# Vivado block design finn_design, xczu7ev-ffvc1156-2-e, Vivado 2024.1
create_bd_design finn_design

create_bd_intf_port -mode Slave -vlnv xilinx.com:interface:axis_rtl:1.0 s_axis_0
set_property -dict [list \
  CONFIG.FREQ_HZ 250000000 \
  CONFIG.HAS_TKEEP 0 \
  CONFIG.HAS_TLAST 0 \
  CONFIG.HAS_TREADY 1 \
  CONFIG.HAS_TSTRB 0 \
  CONFIG.LAYERED_METADATA undef \
  CONFIG.TDATA_NUM_BYTES 2 \
  CONFIG.TDEST_WIDTH 0 \
  CONFIG.TID_WIDTH 0 \
  CONFIG.TUSER_WIDTH 0 \
] [get_bd_intf_ports s_axis_0]
create_bd_intf_port -mode Master -vlnv xilinx.com:interface:axis_rtl:1.0 m_axis_0
set_property -dict {CONFIG.FREQ_HZ 250000000} [get_bd_intf_ports m_axis_0]
create_bd_port -dir I -type clk ap_clk
set_property -dict {CONFIG.FREQ_HZ 250000000} [get_bd_ports ap_clk]
create_bd_port -dir I -type rst ap_rst_n

create_bd_cell -type module -reference StreamingFIFO_rtl_0 StreamingFIFO_rtl_0
create_bd_cell -type module -reference FMPadding_rtl_0 FMPadding_rtl_0
create_bd_cell -type hier StreamingFIFO_rtl_1_0
create_bd_cell -type module -reference StreamingFIFO_rtl_1_1 StreamingFIFO_rtl_1_1
create_bd_cell -type module -reference StreamingDataWidthConverter_rtl_0 StreamingDataWidthConverter_rtl_0
create_bd_cell -type hier StreamingFIFO_rtl_2_0
create_bd_cell -type module -reference StreamingFIFO_rtl_2_1 StreamingFIFO_rtl_2_1
create_bd_cell -type module -reference ConvolutionInputGenerator_rtl_0 ConvolutionInputGenerator_rtl_0
create_bd_cell -type hier StreamingFIFO_rtl_3_0
create_bd_cell -type hier StreamingFIFO_rtl_3_1
create_bd_cell -type module -reference StreamingFIFO_rtl_3_2 StreamingFIFO_rtl_3_2
create_bd_cell -type module -reference StreamingFIFO_rtl_3_3 StreamingFIFO_rtl_3_3
create_bd_cell -type module -reference StreamingDataWidthConverter_rtl_1 StreamingDataWidthConverter_rtl_1
create_bd_cell -type hier StreamingFIFO_rtl_4
create_bd_cell -type hier MVAU_rtl_0
create_bd_cell -type module -reference StreamingFIFO_rtl_5 StreamingFIFO_rtl_5
create_bd_cell -type module -reference Thresholding_rtl_0_axi_wrapper Thresholding_rtl_0
create_bd_cell -type hier StreamingFIFO_rtl_6_0
create_bd_cell -type hier StreamingFIFO_rtl_6_1
create_bd_cell -type hier StreamingFIFO_rtl_6_2
create_bd_cell -type hier StreamingFIFO_rtl_6_3
create_bd_cell -type module -reference StreamingFIFO_rtl_6_4 StreamingFIFO_rtl_6_4
create_bd_cell -type ip -vlnv xilinx.com:hls:StreamingMaxPool_hls_0:1.0 StreamingMaxPool_hls_0
create_bd_cell -type module -reference StreamingFIFO_rtl_7 StreamingFIFO_rtl_7
create_bd_cell -type module -reference StreamingDataWidthConverter_rtl_2 StreamingDataWidthConverter_rtl_2
create_bd_cell -type module -reference StreamingFIFO_rtl_8 StreamingFIFO_rtl_8
create_bd_cell -type module -reference FMPadding_rtl_1 FMPadding_rtl_1
create_bd_cell -type module -reference StreamingFIFO_rtl_9 StreamingFIFO_rtl_9
create_bd_cell -type module -reference StreamingDataWidthConverter_rtl_3 StreamingDataWidthConverter_rtl_3
create_bd_cell -type module -reference StreamingFIFO_rtl_10 StreamingFIFO_rtl_10
create_bd_cell -type module -reference ConvolutionInputGenerator_rtl_1 ConvolutionInputGenerator_rtl_1
create_bd_cell -type module -reference StreamingFIFO_rtl_11 StreamingFIFO_rtl_11
create_bd_cell -type module -reference StreamingDataWidthConverter_rtl_4 StreamingDataWidthConverter_rtl_4
create_bd_cell -type module -reference StreamingFIFO_rtl_12 StreamingFIFO_rtl_12
create_bd_cell -type hier MVAU_rtl_1
create_bd_cell -type module -reference StreamingFIFO_rtl_13 StreamingFIFO_rtl_13
create_bd_cell -type module -reference StreamingDataWidthConverter_rtl_5 StreamingDataWidthConverter_rtl_5
create_bd_cell -type module -reference StreamingFIFO_rtl_14 StreamingFIFO_rtl_14
create_bd_cell -type module -reference Thresholding_rtl_1_axi_wrapper Thresholding_rtl_1
create_bd_cell -type module -reference StreamingFIFO_rtl_15 StreamingFIFO_rtl_15
create_bd_cell -type ip -vlnv xilinx.com:hls:StreamingMaxPool_hls_1:1.0 StreamingMaxPool_hls_1
create_bd_cell -type module -reference StreamingFIFO_rtl_16 StreamingFIFO_rtl_16
create_bd_cell -type module -reference StreamingDataWidthConverter_rtl_6 StreamingDataWidthConverter_rtl_6
create_bd_cell -type module -reference StreamingFIFO_rtl_17 StreamingFIFO_rtl_17
create_bd_cell -type module -reference FMPadding_rtl_2 FMPadding_rtl_2
create_bd_cell -type module -reference StreamingFIFO_rtl_18 StreamingFIFO_rtl_18
create_bd_cell -type module -reference StreamingDataWidthConverter_rtl_7 StreamingDataWidthConverter_rtl_7
create_bd_cell -type module -reference StreamingFIFO_rtl_19 StreamingFIFO_rtl_19
create_bd_cell -type module -reference ConvolutionInputGenerator_rtl_2 ConvolutionInputGenerator_rtl_2
create_bd_cell -type module -reference StreamingFIFO_rtl_20 StreamingFIFO_rtl_20
create_bd_cell -type module -reference StreamingDataWidthConverter_rtl_8 StreamingDataWidthConverter_rtl_8
create_bd_cell -type module -reference StreamingFIFO_rtl_21 StreamingFIFO_rtl_21
create_bd_cell -type hier MVAU_rtl_2
create_bd_cell -type module -reference StreamingFIFO_rtl_22 StreamingFIFO_rtl_22
create_bd_cell -type module -reference StreamingDataWidthConverter_rtl_9 StreamingDataWidthConverter_rtl_9
create_bd_cell -type module -reference StreamingFIFO_rtl_23 StreamingFIFO_rtl_23
create_bd_cell -type module -reference Thresholding_rtl_2_axi_wrapper Thresholding_rtl_2
create_bd_cell -type module -reference StreamingFIFO_rtl_24 StreamingFIFO_rtl_24
create_bd_cell -type ip -vlnv xilinx.com:hls:StreamingMaxPool_hls_2:1.0 StreamingMaxPool_hls_2
create_bd_cell -type module -reference StreamingFIFO_rtl_25 StreamingFIFO_rtl_25
create_bd_cell -type module -reference StreamingDataWidthConverter_rtl_10 StreamingDataWidthConverter_rtl_10
create_bd_cell -type module -reference StreamingFIFO_rtl_26 StreamingFIFO_rtl_26
create_bd_cell -type module -reference FMPadding_rtl_3 FMPadding_rtl_3
create_bd_cell -type module -reference StreamingFIFO_rtl_27 StreamingFIFO_rtl_27
create_bd_cell -type module -reference StreamingDataWidthConverter_rtl_11 StreamingDataWidthConverter_rtl_11
create_bd_cell -type module -reference StreamingFIFO_rtl_28 StreamingFIFO_rtl_28
create_bd_cell -type module -reference ConvolutionInputGenerator_rtl_3 ConvolutionInputGenerator_rtl_3
create_bd_cell -type module -reference StreamingFIFO_rtl_29 StreamingFIFO_rtl_29
create_bd_cell -type module -reference StreamingDataWidthConverter_rtl_12 StreamingDataWidthConverter_rtl_12
create_bd_cell -type module -reference StreamingFIFO_rtl_30 StreamingFIFO_rtl_30
create_bd_cell -type hier MVAU_rtl_3
create_bd_cell -type module -reference StreamingFIFO_rtl_31 StreamingFIFO_rtl_31
create_bd_cell -type module -reference StreamingDataWidthConverter_rtl_13 StreamingDataWidthConverter_rtl_13
create_bd_cell -type module -reference StreamingFIFO_rtl_32 StreamingFIFO_rtl_32
create_bd_cell -type module -reference Thresholding_rtl_3_axi_wrapper Thresholding_rtl_3
create_bd_cell -type module -reference StreamingFIFO_rtl_33 StreamingFIFO_rtl_33
create_bd_cell -type ip -vlnv xilinx.com:hls:StreamingMaxPool_hls_3:1.0 StreamingMaxPool_hls_3
create_bd_cell -type module -reference StreamingFIFO_rtl_34 StreamingFIFO_rtl_34
create_bd_cell -type module -reference StreamingDataWidthConverter_rtl_14 StreamingDataWidthConverter_rtl_14
create_bd_cell -type module -reference StreamingFIFO_rtl_35 StreamingFIFO_rtl_35
create_bd_cell -type module -reference FMPadding_rtl_4 FMPadding_rtl_4
create_bd_cell -type module -reference StreamingFIFO_rtl_36 StreamingFIFO_rtl_36
create_bd_cell -type module -reference StreamingDataWidthConverter_rtl_15 StreamingDataWidthConverter_rtl_15
create_bd_cell -type module -reference StreamingFIFO_rtl_37 StreamingFIFO_rtl_37
create_bd_cell -type module -reference ConvolutionInputGenerator_rtl_4 ConvolutionInputGenerator_rtl_4
create_bd_cell -type module -reference StreamingFIFO_rtl_38 StreamingFIFO_rtl_38
create_bd_cell -type module -reference StreamingDataWidthConverter_rtl_16 StreamingDataWidthConverter_rtl_16
create_bd_cell -type module -reference StreamingFIFO_rtl_39 StreamingFIFO_rtl_39
create_bd_cell -type hier MVAU_rtl_4
create_bd_cell -type module -reference StreamingFIFO_rtl_40 StreamingFIFO_rtl_40
create_bd_cell -type module -reference StreamingDataWidthConverter_rtl_17 StreamingDataWidthConverter_rtl_17
create_bd_cell -type module -reference StreamingFIFO_rtl_41 StreamingFIFO_rtl_41
create_bd_cell -type module -reference Thresholding_rtl_4_axi_wrapper Thresholding_rtl_4
create_bd_cell -type module -reference StreamingFIFO_rtl_42 StreamingFIFO_rtl_42
create_bd_cell -type ip -vlnv xilinx.com:hls:StreamingMaxPool_hls_4:1.0 StreamingMaxPool_hls_4
create_bd_cell -type module -reference StreamingFIFO_rtl_43 StreamingFIFO_rtl_43
create_bd_cell -type module -reference StreamingDataWidthConverter_rtl_18 StreamingDataWidthConverter_rtl_18
create_bd_cell -type module -reference StreamingFIFO_rtl_44 StreamingFIFO_rtl_44
create_bd_cell -type module -reference FMPadding_rtl_5 FMPadding_rtl_5
create_bd_cell -type module -reference StreamingFIFO_rtl_45 StreamingFIFO_rtl_45
create_bd_cell -type module -reference StreamingDataWidthConverter_rtl_19 StreamingDataWidthConverter_rtl_19
create_bd_cell -type module -reference StreamingFIFO_rtl_46 StreamingFIFO_rtl_46
create_bd_cell -type module -reference ConvolutionInputGenerator_rtl_5 ConvolutionInputGenerator_rtl_5
create_bd_cell -type module -reference StreamingFIFO_rtl_47 StreamingFIFO_rtl_47
create_bd_cell -type module -reference StreamingDataWidthConverter_rtl_20 StreamingDataWidthConverter_rtl_20
create_bd_cell -type module -reference StreamingFIFO_rtl_48 StreamingFIFO_rtl_48
create_bd_cell -type hier MVAU_rtl_5
create_bd_cell -type module -reference StreamingFIFO_rtl_49 StreamingFIFO_rtl_49
create_bd_cell -type module -reference Thresholding_rtl_5_axi_wrapper Thresholding_rtl_5
create_bd_cell -type module -reference StreamingFIFO_rtl_50 StreamingFIFO_rtl_50
create_bd_cell -type ip -vlnv xilinx.com:hls:StreamingMaxPool_hls_5:1.0 StreamingMaxPool_hls_5
create_bd_cell -type module -reference StreamingFIFO_rtl_51 StreamingFIFO_rtl_51
create_bd_cell -type module -reference StreamingDataWidthConverter_rtl_21 StreamingDataWidthConverter_rtl_21
create_bd_cell -type module -reference StreamingFIFO_rtl_52 StreamingFIFO_rtl_52
create_bd_cell -type module -reference FMPadding_rtl_6 FMPadding_rtl_6
create_bd_cell -type module -reference StreamingFIFO_rtl_53 StreamingFIFO_rtl_53
create_bd_cell -type module -reference StreamingDataWidthConverter_rtl_22 StreamingDataWidthConverter_rtl_22
create_bd_cell -type module -reference StreamingFIFO_rtl_54 StreamingFIFO_rtl_54
create_bd_cell -type module -reference ConvolutionInputGenerator_rtl_6 ConvolutionInputGenerator_rtl_6
create_bd_cell -type module -reference StreamingFIFO_rtl_55 StreamingFIFO_rtl_55
create_bd_cell -type module -reference StreamingDataWidthConverter_rtl_23 StreamingDataWidthConverter_rtl_23
create_bd_cell -type module -reference StreamingFIFO_rtl_56 StreamingFIFO_rtl_56
create_bd_cell -type hier MVAU_rtl_6
create_bd_cell -type module -reference StreamingFIFO_rtl_57 StreamingFIFO_rtl_57
create_bd_cell -type module -reference Thresholding_rtl_6_axi_wrapper Thresholding_rtl_6
create_bd_cell -type module -reference StreamingFIFO_rtl_58 StreamingFIFO_rtl_58
create_bd_cell -type ip -vlnv xilinx.com:hls:StreamingMaxPool_hls_6:1.0 StreamingMaxPool_hls_6
create_bd_cell -type module -reference StreamingFIFO_rtl_59 StreamingFIFO_rtl_59
create_bd_cell -type hier MVAU_rtl_7
create_bd_cell -type module -reference StreamingFIFO_rtl_60 StreamingFIFO_rtl_60
create_bd_cell -type module -reference Thresholding_rtl_7_axi_wrapper Thresholding_rtl_7
create_bd_cell -type module -reference StreamingFIFO_rtl_61 StreamingFIFO_rtl_61
create_bd_cell -type hier MVAU_rtl_8
create_bd_cell -type module -reference StreamingFIFO_rtl_62 StreamingFIFO_rtl_62
create_bd_cell -type module -reference Thresholding_rtl_8_axi_wrapper Thresholding_rtl_8
create_bd_cell -type module -reference StreamingFIFO_rtl_63 StreamingFIFO_rtl_63
create_bd_cell -type hier MVAU_rtl_9
create_bd_cell -type module -reference StreamingFIFO_rtl_64 StreamingFIFO_rtl_64
create_bd_cell -type ip -vlnv xilinx.com:hls:ChannelwiseOp_hls_0:1.0 ChannelwiseOp_hls_0
create_bd_cell -type module -reference StreamingFIFO_rtl_65 StreamingFIFO_rtl_65
create_bd_cell -type ip -vlnv xilinx.com:hls:LabelSelect_hls_0:1.0 LabelSelect_hls_0
create_bd_cell -type module -reference StreamingFIFO_rtl_66 StreamingFIFO_rtl_66

# ---- hierarchy /StreamingFIFO_rtl_1_0 ----
current_bd_instance /StreamingFIFO_rtl_1_0
create_bd_intf_pin -mode Master -vlnv xilinx.com:interface:axis_rtl:1.0 out_V
create_bd_intf_pin -mode Slave -vlnv xilinx.com:interface:axis_rtl:1.0 in0_V
create_bd_pin -dir I -type clk ap_clk
create_bd_pin -dir I -type rst ap_rst_n

create_bd_cell -type ip -vlnv xilinx.com:ip:axis_data_fifo:2.0 fifo
set_property -dict {CONFIG.FIFO_DEPTH 1024 CONFIG.FIFO_MEMORY_TYPE auto CONFIG.TDATA_NUM_BYTES 2} [get_bd_cells fifo]

# ---- hierarchy /StreamingFIFO_rtl_2_0 ----
current_bd_instance /StreamingFIFO_rtl_2_0
create_bd_intf_pin -mode Master -vlnv xilinx.com:interface:axis_rtl:1.0 out_V
create_bd_intf_pin -mode Slave -vlnv xilinx.com:interface:axis_rtl:1.0 in0_V
create_bd_pin -dir I -type clk ap_clk
create_bd_pin -dir I -type rst ap_rst_n

create_bd_cell -type ip -vlnv xilinx.com:ip:axis_data_fifo:2.0 fifo
set_property -dict {CONFIG.FIFO_DEPTH 2048 CONFIG.FIFO_MEMORY_TYPE auto CONFIG.TDATA_NUM_BYTES 1} [get_bd_cells fifo]

# ---- hierarchy /StreamingFIFO_rtl_3_0 ----
current_bd_instance /StreamingFIFO_rtl_3_0
create_bd_intf_pin -mode Master -vlnv xilinx.com:interface:axis_rtl:1.0 out_V
create_bd_intf_pin -mode Slave -vlnv xilinx.com:interface:axis_rtl:1.0 in0_V
create_bd_pin -dir I -type clk ap_clk
create_bd_pin -dir I -type rst ap_rst_n

create_bd_cell -type ip -vlnv xilinx.com:ip:axis_data_fifo:2.0 fifo
set_property -dict {CONFIG.FIFO_DEPTH 4096 CONFIG.FIFO_MEMORY_TYPE auto CONFIG.TDATA_NUM_BYTES 1} [get_bd_cells fifo]

# ---- hierarchy /StreamingFIFO_rtl_3_1 ----
current_bd_instance /StreamingFIFO_rtl_3_1
create_bd_intf_pin -mode Master -vlnv xilinx.com:interface:axis_rtl:1.0 out_V
create_bd_intf_pin -mode Slave -vlnv xilinx.com:interface:axis_rtl:1.0 in0_V
create_bd_pin -dir I -type clk ap_clk
create_bd_pin -dir I -type rst ap_rst_n

create_bd_cell -type ip -vlnv xilinx.com:ip:axis_data_fifo:2.0 fifo
set_property -dict {CONFIG.FIFO_DEPTH 512 CONFIG.FIFO_MEMORY_TYPE auto CONFIG.TDATA_NUM_BYTES 1} [get_bd_cells fifo]

# ---- hierarchy /StreamingFIFO_rtl_4 ----
current_bd_instance /StreamingFIFO_rtl_4
create_bd_intf_pin -mode Master -vlnv xilinx.com:interface:axis_rtl:1.0 out_V
create_bd_intf_pin -mode Slave -vlnv xilinx.com:interface:axis_rtl:1.0 in0_V
create_bd_pin -dir I -type clk ap_clk
create_bd_pin -dir I -type rst ap_rst_n

create_bd_cell -type ip -vlnv xilinx.com:ip:axis_data_fifo:2.0 fifo
set_property -dict {CONFIG.FIFO_DEPTH 1024 CONFIG.FIFO_MEMORY_TYPE auto CONFIG.TDATA_NUM_BYTES 6} [get_bd_cells fifo]

# ---- hierarchy /MVAU_rtl_0 ----
current_bd_instance /MVAU_rtl_0
create_bd_intf_pin -mode Master -vlnv xilinx.com:interface:axis_rtl:1.0 out_V
create_bd_intf_pin -mode Slave -vlnv xilinx.com:interface:axis_rtl:1.0 in0_V
create_bd_pin -dir I -type clk ap_clk
create_bd_pin -dir I -type rst ap_rst_n

create_bd_cell -type module -reference MVAU_rtl_0 MVAU_rtl_0
create_bd_cell -type ip -vlnv amd.com:finn:memstream:1.0 MVAU_rtl_0_wstrm
set_property -dict [list \
  CONFIG.DEPTH 64 \
  CONFIG.INIT_FILE /home/phu/repos/PytorchModClassNew/RadioFINN/notebooks/Radio_27ML/tmp//code_gen_ipgen_MVAU_rtl_0_stk8ixk_/memblock.dat \
  CONFIG.RAM_STYLE auto \
  CONFIG.WIDTH 48 \
] [get_bd_cells MVAU_rtl_0_wstrm]

# ---- hierarchy /StreamingFIFO_rtl_6_0 ----
current_bd_instance /StreamingFIFO_rtl_6_0
create_bd_intf_pin -mode Master -vlnv xilinx.com:interface:axis_rtl:1.0 out_V
create_bd_intf_pin -mode Slave -vlnv xilinx.com:interface:axis_rtl:1.0 in0_V
create_bd_pin -dir I -type clk ap_clk
create_bd_pin -dir I -type rst ap_rst_n

create_bd_cell -type ip -vlnv xilinx.com:ip:axis_data_fifo:2.0 fifo
set_property -dict {CONFIG.FIFO_DEPTH 32768 CONFIG.FIFO_MEMORY_TYPE auto CONFIG.TDATA_NUM_BYTES 1} [get_bd_cells fifo]

# ---- hierarchy /StreamingFIFO_rtl_6_1 ----
current_bd_instance /StreamingFIFO_rtl_6_1
create_bd_intf_pin -mode Master -vlnv xilinx.com:interface:axis_rtl:1.0 out_V
create_bd_intf_pin -mode Slave -vlnv xilinx.com:interface:axis_rtl:1.0 in0_V
create_bd_pin -dir I -type clk ap_clk
create_bd_pin -dir I -type rst ap_rst_n

create_bd_cell -type ip -vlnv xilinx.com:ip:axis_data_fifo:2.0 fifo
set_property -dict {CONFIG.FIFO_DEPTH 8192 CONFIG.FIFO_MEMORY_TYPE auto CONFIG.TDATA_NUM_BYTES 1} [get_bd_cells fifo]

# ---- hierarchy /StreamingFIFO_rtl_6_2 ----
current_bd_instance /StreamingFIFO_rtl_6_2
create_bd_intf_pin -mode Master -vlnv xilinx.com:interface:axis_rtl:1.0 out_V
create_bd_intf_pin -mode Slave -vlnv xilinx.com:interface:axis_rtl:1.0 in0_V
create_bd_pin -dir I -type clk ap_clk
create_bd_pin -dir I -type rst ap_rst_n

create_bd_cell -type ip -vlnv xilinx.com:ip:axis_data_fifo:2.0 fifo
set_property -dict {CONFIG.FIFO_DEPTH 4096 CONFIG.FIFO_MEMORY_TYPE auto CONFIG.TDATA_NUM_BYTES 1} [get_bd_cells fifo]

# ---- hierarchy /StreamingFIFO_rtl_6_3 ----
current_bd_instance /StreamingFIFO_rtl_6_3
create_bd_intf_pin -mode Master -vlnv xilinx.com:interface:axis_rtl:1.0 out_V
create_bd_intf_pin -mode Slave -vlnv xilinx.com:interface:axis_rtl:1.0 in0_V
create_bd_pin -dir I -type clk ap_clk
create_bd_pin -dir I -type rst ap_rst_n

create_bd_cell -type ip -vlnv xilinx.com:ip:axis_data_fifo:2.0 fifo
set_property -dict {CONFIG.FIFO_DEPTH 2048 CONFIG.FIFO_MEMORY_TYPE auto CONFIG.TDATA_NUM_BYTES 1} [get_bd_cells fifo]

# ---- hierarchy /MVAU_rtl_1 ----
current_bd_instance /MVAU_rtl_1
create_bd_intf_pin -mode Master -vlnv xilinx.com:interface:axis_rtl:1.0 out_V
create_bd_intf_pin -mode Slave -vlnv xilinx.com:interface:axis_rtl:1.0 in0_V
create_bd_pin -dir I -type clk ap_clk
create_bd_pin -dir I -type rst ap_rst_n

create_bd_cell -type module -reference MVAU_rtl_1 MVAU_rtl_1
create_bd_cell -type ip -vlnv amd.com:finn:memstream:1.0 MVAU_rtl_1_wstrm
set_property -dict [list \
  CONFIG.DEPTH 96 \
  CONFIG.INIT_FILE /home/phu/repos/PytorchModClassNew/RadioFINN/notebooks/Radio_27ML/tmp//code_gen_ipgen_MVAU_rtl_1_zqeudctg/memblock.dat \
  CONFIG.RAM_STYLE auto \
  CONFIG.WIDTH 1024 \
] [get_bd_cells MVAU_rtl_1_wstrm]

# ---- hierarchy /MVAU_rtl_2 ----
current_bd_instance /MVAU_rtl_2
create_bd_intf_pin -mode Master -vlnv xilinx.com:interface:axis_rtl:1.0 out_V
create_bd_intf_pin -mode Slave -vlnv xilinx.com:interface:axis_rtl:1.0 in0_V
create_bd_pin -dir I -type clk ap_clk
create_bd_pin -dir I -type rst ap_rst_n

create_bd_cell -type module -reference MVAU_rtl_2 MVAU_rtl_2
create_bd_cell -type ip -vlnv amd.com:finn:memstream:1.0 MVAU_rtl_2_wstrm
set_property -dict [list \
  CONFIG.DEPTH 192 \
  CONFIG.INIT_FILE /home/phu/repos/PytorchModClassNew/RadioFINN/notebooks/Radio_27ML/tmp//code_gen_ipgen_MVAU_rtl_2_oeq4dach/memblock.dat \
  CONFIG.RAM_STYLE auto \
  CONFIG.WIDTH 512 \
] [get_bd_cells MVAU_rtl_2_wstrm]

# ---- hierarchy /MVAU_rtl_3 ----
current_bd_instance /MVAU_rtl_3
create_bd_intf_pin -mode Master -vlnv xilinx.com:interface:axis_rtl:1.0 out_V
create_bd_intf_pin -mode Slave -vlnv xilinx.com:interface:axis_rtl:1.0 in0_V
create_bd_pin -dir I -type clk ap_clk
create_bd_pin -dir I -type rst ap_rst_n

create_bd_cell -type module -reference MVAU_rtl_3 MVAU_rtl_3
create_bd_cell -type ip -vlnv amd.com:finn:memstream:1.0 MVAU_rtl_3_wstrm
set_property -dict [list \
  CONFIG.DEPTH 384 \
  CONFIG.INIT_FILE /home/phu/repos/PytorchModClassNew/RadioFINN/notebooks/Radio_27ML/tmp//code_gen_ipgen_MVAU_rtl_3_0ba2zerz/memblock.dat \
  CONFIG.RAM_STYLE auto \
  CONFIG.WIDTH 256 \
] [get_bd_cells MVAU_rtl_3_wstrm]

# ---- hierarchy /MVAU_rtl_4 ----
current_bd_instance /MVAU_rtl_4
create_bd_intf_pin -mode Master -vlnv xilinx.com:interface:axis_rtl:1.0 out_V
create_bd_intf_pin -mode Slave -vlnv xilinx.com:interface:axis_rtl:1.0 in0_V
create_bd_pin -dir I -type clk ap_clk
create_bd_pin -dir I -type rst ap_rst_n

create_bd_cell -type module -reference MVAU_rtl_4 MVAU_rtl_4
create_bd_cell -type ip -vlnv amd.com:finn:memstream:1.0 MVAU_rtl_4_wstrm
set_property -dict [list \
  CONFIG.DEPTH 768 \
  CONFIG.INIT_FILE /home/phu/repos/PytorchModClassNew/RadioFINN/notebooks/Radio_27ML/tmp//code_gen_ipgen_MVAU_rtl_4_ynhrbura/memblock.dat \
  CONFIG.RAM_STYLE auto \
  CONFIG.WIDTH 128 \
] [get_bd_cells MVAU_rtl_4_wstrm]

# ---- hierarchy /MVAU_rtl_5 ----
current_bd_instance /MVAU_rtl_5
create_bd_intf_pin -mode Master -vlnv xilinx.com:interface:axis_rtl:1.0 out_V
create_bd_intf_pin -mode Slave -vlnv xilinx.com:interface:axis_rtl:1.0 in0_V
create_bd_pin -dir I -type clk ap_clk
create_bd_pin -dir I -type rst ap_rst_n

create_bd_cell -type module -reference MVAU_rtl_5 MVAU_rtl_5
create_bd_cell -type ip -vlnv amd.com:finn:memstream:1.0 MVAU_rtl_5_wstrm
set_property -dict [list \
  CONFIG.DEPTH 2048 \
  CONFIG.INIT_FILE /home/phu/repos/PytorchModClassNew/RadioFINN/notebooks/Radio_27ML/tmp//code_gen_ipgen_MVAU_rtl_5_044bw2qu/memblock.dat \
  CONFIG.RAM_STYLE auto \
  CONFIG.WIDTH 48 \
] [get_bd_cells MVAU_rtl_5_wstrm]

# ---- hierarchy /MVAU_rtl_6 ----
current_bd_instance /MVAU_rtl_6
create_bd_intf_pin -mode Master -vlnv xilinx.com:interface:axis_rtl:1.0 out_V
create_bd_intf_pin -mode Slave -vlnv xilinx.com:interface:axis_rtl:1.0 in0_V
create_bd_pin -dir I -type clk ap_clk
create_bd_pin -dir I -type rst ap_rst_n

create_bd_cell -type module -reference MVAU_rtl_6 MVAU_rtl_6
create_bd_cell -type ip -vlnv amd.com:finn:memstream:1.0 MVAU_rtl_6_wstrm
set_property -dict [list \
  CONFIG.DEPTH 4096 \
  CONFIG.INIT_FILE /home/phu/repos/PytorchModClassNew/RadioFINN/notebooks/Radio_27ML/tmp//code_gen_ipgen_MVAU_rtl_6_kudosabw/memblock.dat \
  CONFIG.RAM_STYLE auto \
  CONFIG.WIDTH 24 \
] [get_bd_cells MVAU_rtl_6_wstrm]

# ---- hierarchy /MVAU_rtl_7 ----
current_bd_instance /MVAU_rtl_7
create_bd_intf_pin -mode Master -vlnv xilinx.com:interface:axis_rtl:1.0 out_V
create_bd_intf_pin -mode Slave -vlnv xilinx.com:interface:axis_rtl:1.0 in0_V
create_bd_pin -dir I -type clk ap_clk
create_bd_pin -dir I -type rst ap_rst_n

create_bd_cell -type module -reference MVAU_rtl_7 MVAU_rtl_7
create_bd_cell -type ip -vlnv amd.com:finn:memstream:1.0 MVAU_rtl_7_wstrm
set_property -dict [list \
  CONFIG.DEPTH 65536 \
  CONFIG.INIT_FILE /home/phu/repos/PytorchModClassNew/RadioFINN/notebooks/Radio_27ML/tmp//code_gen_ipgen_MVAU_rtl_7_gfiyws_m/memblock.dat \
  CONFIG.RAM_STYLE auto \
  CONFIG.WIDTH 8 \
] [get_bd_cells MVAU_rtl_7_wstrm]

# ---- hierarchy /MVAU_rtl_8 ----
current_bd_instance /MVAU_rtl_8
create_bd_intf_pin -mode Master -vlnv xilinx.com:interface:axis_rtl:1.0 out_V
create_bd_intf_pin -mode Slave -vlnv xilinx.com:interface:axis_rtl:1.0 in0_V
create_bd_pin -dir I -type clk ap_clk
create_bd_pin -dir I -type rst ap_rst_n

create_bd_cell -type module -reference MVAU_rtl_8 MVAU_rtl_8
create_bd_cell -type ip -vlnv amd.com:finn:memstream:1.0 MVAU_rtl_8_wstrm
set_property -dict [list \
  CONFIG.DEPTH 16384 \
  CONFIG.INIT_FILE /home/phu/repos/PytorchModClassNew/RadioFINN/notebooks/Radio_27ML/tmp//code_gen_ipgen_MVAU_rtl_8_ss72c51x/memblock.dat \
  CONFIG.RAM_STYLE auto \
  CONFIG.WIDTH 8 \
] [get_bd_cells MVAU_rtl_8_wstrm]

# ---- hierarchy /MVAU_rtl_9 ----
current_bd_instance /MVAU_rtl_9
create_bd_intf_pin -mode Master -vlnv xilinx.com:interface:axis_rtl:1.0 out_V
create_bd_intf_pin -mode Slave -vlnv xilinx.com:interface:axis_rtl:1.0 in0_V
create_bd_pin -dir I -type clk ap_clk
create_bd_pin -dir I -type rst ap_rst_n

create_bd_cell -type module -reference MVAU_rtl_9 MVAU_rtl_9
create_bd_cell -type ip -vlnv amd.com:finn:memstream:1.0 MVAU_rtl_9_wstrm
set_property -dict [list \
  CONFIG.DEPTH 3456 \
  CONFIG.INIT_FILE /home/phu/repos/PytorchModClassNew/RadioFINN/notebooks/Radio_27ML/tmp//code_gen_ipgen_MVAU_rtl_9_jqypr93c/memblock.dat \
  CONFIG.RAM_STYLE auto \
  CONFIG.WIDTH 8 \
] [get_bd_cells MVAU_rtl_9_wstrm]

# ---- connections ----

current_bd_instance /StreamingFIFO_rtl_1_0
connect_bd_intf_net [get_bd_intf_pins fifo/M_AXIS] [get_bd_intf_pins out_V]
connect_bd_intf_net [get_bd_intf_pins fifo/S_AXIS] [get_bd_intf_pins in0_V]
connect_bd_net [get_bd_pins ap_clk] [get_bd_pins fifo/s_axis_aclk]
connect_bd_net [get_bd_pins ap_rst_n] [get_bd_pins fifo/s_axis_aresetn]

current_bd_instance /StreamingFIFO_rtl_2_0
connect_bd_intf_net [get_bd_intf_pins fifo/M_AXIS] [get_bd_intf_pins out_V]
connect_bd_intf_net [get_bd_intf_pins fifo/S_AXIS] [get_bd_intf_pins in0_V]
connect_bd_net [get_bd_pins ap_clk] [get_bd_pins fifo/s_axis_aclk]
connect_bd_net [get_bd_pins ap_rst_n] [get_bd_pins fifo/s_axis_aresetn]

current_bd_instance /StreamingFIFO_rtl_3_0
connect_bd_intf_net [get_bd_intf_pins fifo/M_AXIS] [get_bd_intf_pins out_V]
connect_bd_intf_net [get_bd_intf_pins fifo/S_AXIS] [get_bd_intf_pins in0_V]
connect_bd_net [get_bd_pins ap_clk] [get_bd_pins fifo/s_axis_aclk]
connect_bd_net [get_bd_pins ap_rst_n] [get_bd_pins fifo/s_axis_aresetn]

current_bd_instance /StreamingFIFO_rtl_3_1
connect_bd_intf_net [get_bd_intf_pins fifo/M_AXIS] [get_bd_intf_pins out_V]
connect_bd_intf_net [get_bd_intf_pins fifo/S_AXIS] [get_bd_intf_pins in0_V]
connect_bd_net [get_bd_pins ap_clk] [get_bd_pins fifo/s_axis_aclk]
connect_bd_net [get_bd_pins ap_rst_n] [get_bd_pins fifo/s_axis_aresetn]

current_bd_instance /StreamingFIFO_rtl_4
connect_bd_intf_net [get_bd_intf_pins fifo/M_AXIS] [get_bd_intf_pins out_V]
connect_bd_intf_net [get_bd_intf_pins fifo/S_AXIS] [get_bd_intf_pins in0_V]
connect_bd_net [get_bd_pins ap_clk] [get_bd_pins fifo/s_axis_aclk]
connect_bd_net [get_bd_pins ap_rst_n] [get_bd_pins fifo/s_axis_aresetn]

current_bd_instance /MVAU_rtl_0
connect_bd_intf_net [get_bd_intf_pins out_V] [get_bd_intf_pins MVAU_rtl_0/out_V]
connect_bd_intf_net [get_bd_intf_pins MVAU_rtl_0_wstrm/m_axis_0] [get_bd_intf_pins MVAU_rtl_0/weights_V]
connect_bd_intf_net [get_bd_intf_pins in0_V] [get_bd_intf_pins MVAU_rtl_0/in0_V]
connect_bd_net [get_bd_pins ap_clk] [get_bd_pins MVAU_rtl_0_wstrm/ap_clk] [get_bd_pins MVAU_rtl_0/ap_clk]
connect_bd_net [get_bd_pins ap_rst_n] [get_bd_pins MVAU_rtl_0_wstrm/ap_rst_n] [get_bd_pins MVAU_rtl_0/ap_rst_n]

current_bd_instance /StreamingFIFO_rtl_6_0
connect_bd_intf_net [get_bd_intf_pins fifo/M_AXIS] [get_bd_intf_pins out_V]
connect_bd_intf_net [get_bd_intf_pins fifo/S_AXIS] [get_bd_intf_pins in0_V]
connect_bd_net [get_bd_pins ap_clk] [get_bd_pins fifo/s_axis_aclk]
connect_bd_net [get_bd_pins ap_rst_n] [get_bd_pins fifo/s_axis_aresetn]

current_bd_instance /StreamingFIFO_rtl_6_1
connect_bd_intf_net [get_bd_intf_pins fifo/M_AXIS] [get_bd_intf_pins out_V]
connect_bd_intf_net [get_bd_intf_pins fifo/S_AXIS] [get_bd_intf_pins in0_V]
connect_bd_net [get_bd_pins ap_clk] [get_bd_pins fifo/s_axis_aclk]
connect_bd_net [get_bd_pins ap_rst_n] [get_bd_pins fifo/s_axis_aresetn]

current_bd_instance /StreamingFIFO_rtl_6_2
connect_bd_intf_net [get_bd_intf_pins fifo/M_AXIS] [get_bd_intf_pins out_V]
connect_bd_intf_net [get_bd_intf_pins fifo/S_AXIS] [get_bd_intf_pins in0_V]
connect_bd_net [get_bd_pins ap_clk] [get_bd_pins fifo/s_axis_aclk]
connect_bd_net [get_bd_pins ap_rst_n] [get_bd_pins fifo/s_axis_aresetn]

current_bd_instance /StreamingFIFO_rtl_6_3
connect_bd_intf_net [get_bd_intf_pins fifo/M_AXIS] [get_bd_intf_pins out_V]
connect_bd_intf_net [get_bd_intf_pins fifo/S_AXIS] [get_bd_intf_pins in0_V]
connect_bd_net [get_bd_pins ap_clk] [get_bd_pins fifo/s_axis_aclk]
connect_bd_net [get_bd_pins ap_rst_n] [get_bd_pins fifo/s_axis_aresetn]

current_bd_instance /MVAU_rtl_1
connect_bd_intf_net [get_bd_intf_pins out_V] [get_bd_intf_pins MVAU_rtl_1/out_V]
connect_bd_intf_net [get_bd_intf_pins MVAU_rtl_1_wstrm/m_axis_0] [get_bd_intf_pins MVAU_rtl_1/weights_V]
connect_bd_intf_net [get_bd_intf_pins in0_V] [get_bd_intf_pins MVAU_rtl_1/in0_V]
connect_bd_net [get_bd_pins ap_clk] [get_bd_pins MVAU_rtl_1_wstrm/ap_clk] [get_bd_pins MVAU_rtl_1/ap_clk]
connect_bd_net [get_bd_pins ap_rst_n] [get_bd_pins MVAU_rtl_1_wstrm/ap_rst_n] [get_bd_pins MVAU_rtl_1/ap_rst_n]

current_bd_instance /MVAU_rtl_2
connect_bd_intf_net [get_bd_intf_pins out_V] [get_bd_intf_pins MVAU_rtl_2/out_V]
connect_bd_intf_net [get_bd_intf_pins MVAU_rtl_2_wstrm/m_axis_0] [get_bd_intf_pins MVAU_rtl_2/weights_V]
connect_bd_intf_net [get_bd_intf_pins in0_V] [get_bd_intf_pins MVAU_rtl_2/in0_V]
connect_bd_net [get_bd_pins ap_clk] [get_bd_pins MVAU_rtl_2_wstrm/ap_clk] [get_bd_pins MVAU_rtl_2/ap_clk]
connect_bd_net [get_bd_pins ap_rst_n] [get_bd_pins MVAU_rtl_2_wstrm/ap_rst_n] [get_bd_pins MVAU_rtl_2/ap_rst_n]

current_bd_instance /MVAU_rtl_3
connect_bd_intf_net [get_bd_intf_pins out_V] [get_bd_intf_pins MVAU_rtl_3/out_V]
connect_bd_intf_net [get_bd_intf_pins MVAU_rtl_3_wstrm/m_axis_0] [get_bd_intf_pins MVAU_rtl_3/weights_V]
connect_bd_intf_net [get_bd_intf_pins in0_V] [get_bd_intf_pins MVAU_rtl_3/in0_V]
connect_bd_net [get_bd_pins ap_clk] [get_bd_pins MVAU_rtl_3_wstrm/ap_clk] [get_bd_pins MVAU_rtl_3/ap_clk]
connect_bd_net [get_bd_pins ap_rst_n] [get_bd_pins MVAU_rtl_3_wstrm/ap_rst_n] [get_bd_pins MVAU_rtl_3/ap_rst_n]

current_bd_instance /MVAU_rtl_4
connect_bd_intf_net [get_bd_intf_pins out_V] [get_bd_intf_pins MVAU_rtl_4/out_V]
connect_bd_intf_net [get_bd_intf_pins MVAU_rtl_4_wstrm/m_axis_0] [get_bd_intf_pins MVAU_rtl_4/weights_V]
connect_bd_intf_net [get_bd_intf_pins in0_V] [get_bd_intf_pins MVAU_rtl_4/in0_V]
connect_bd_net [get_bd_pins ap_clk] [get_bd_pins MVAU_rtl_4_wstrm/ap_clk] [get_bd_pins MVAU_rtl_4/ap_clk]
connect_bd_net [get_bd_pins ap_rst_n] [get_bd_pins MVAU_rtl_4_wstrm/ap_rst_n] [get_bd_pins MVAU_rtl_4/ap_rst_n]

current_bd_instance /MVAU_rtl_5
connect_bd_intf_net [get_bd_intf_pins out_V] [get_bd_intf_pins MVAU_rtl_5/out_V]
connect_bd_intf_net [get_bd_intf_pins MVAU_rtl_5_wstrm/m_axis_0] [get_bd_intf_pins MVAU_rtl_5/weights_V]
connect_bd_intf_net [get_bd_intf_pins in0_V] [get_bd_intf_pins MVAU_rtl_5/in0_V]
connect_bd_net [get_bd_pins ap_clk] [get_bd_pins MVAU_rtl_5_wstrm/ap_clk] [get_bd_pins MVAU_rtl_5/ap_clk]
connect_bd_net [get_bd_pins ap_rst_n] [get_bd_pins MVAU_rtl_5_wstrm/ap_rst_n] [get_bd_pins MVAU_rtl_5/ap_rst_n]

current_bd_instance /MVAU_rtl_6
connect_bd_intf_net [get_bd_intf_pins out_V] [get_bd_intf_pins MVAU_rtl_6/out_V]
connect_bd_intf_net [get_bd_intf_pins MVAU_rtl_6_wstrm/m_axis_0] [get_bd_intf_pins MVAU_rtl_6/weights_V]
connect_bd_intf_net [get_bd_intf_pins in0_V] [get_bd_intf_pins MVAU_rtl_6/in0_V]
connect_bd_net [get_bd_pins ap_clk] [get_bd_pins MVAU_rtl_6_wstrm/ap_clk] [get_bd_pins MVAU_rtl_6/ap_clk]
connect_bd_net [get_bd_pins ap_rst_n] [get_bd_pins MVAU_rtl_6_wstrm/ap_rst_n] [get_bd_pins MVAU_rtl_6/ap_rst_n]

current_bd_instance /MVAU_rtl_7
connect_bd_intf_net [get_bd_intf_pins out_V] [get_bd_intf_pins MVAU_rtl_7/out_V]
connect_bd_intf_net [get_bd_intf_pins MVAU_rtl_7_wstrm/m_axis_0] [get_bd_intf_pins MVAU_rtl_7/weights_V]
connect_bd_intf_net [get_bd_intf_pins in0_V] [get_bd_intf_pins MVAU_rtl_7/in0_V]
connect_bd_net [get_bd_pins ap_clk] [get_bd_pins MVAU_rtl_7_wstrm/ap_clk] [get_bd_pins MVAU_rtl_7/ap_clk]
connect_bd_net [get_bd_pins ap_rst_n] [get_bd_pins MVAU_rtl_7_wstrm/ap_rst_n] [get_bd_pins MVAU_rtl_7/ap_rst_n]

current_bd_instance /MVAU_rtl_8
connect_bd_intf_net [get_bd_intf_pins out_V] [get_bd_intf_pins MVAU_rtl_8/out_V]
connect_bd_intf_net [get_bd_intf_pins MVAU_rtl_8_wstrm/m_axis_0] [get_bd_intf_pins MVAU_rtl_8/weights_V]
connect_bd_intf_net [get_bd_intf_pins in0_V] [get_bd_intf_pins MVAU_rtl_8/in0_V]
connect_bd_net [get_bd_pins ap_clk] [get_bd_pins MVAU_rtl_8_wstrm/ap_clk] [get_bd_pins MVAU_rtl_8/ap_clk]
connect_bd_net [get_bd_pins ap_rst_n] [get_bd_pins MVAU_rtl_8_wstrm/ap_rst_n] [get_bd_pins MVAU_rtl_8/ap_rst_n]

current_bd_instance /MVAU_rtl_9
connect_bd_intf_net [get_bd_intf_pins out_V] [get_bd_intf_pins MVAU_rtl_9/out_V]
connect_bd_intf_net [get_bd_intf_pins MVAU_rtl_9_wstrm/m_axis_0] [get_bd_intf_pins MVAU_rtl_9/weights_V]
connect_bd_intf_net [get_bd_intf_pins in0_V] [get_bd_intf_pins MVAU_rtl_9/in0_V]
connect_bd_net [get_bd_pins ap_clk] [get_bd_pins MVAU_rtl_9_wstrm/ap_clk] [get_bd_pins MVAU_rtl_9/ap_clk]
connect_bd_net [get_bd_pins ap_rst_n] [get_bd_pins MVAU_rtl_9_wstrm/ap_rst_n] [get_bd_pins MVAU_rtl_9/ap_rst_n]

current_bd_instance /
connect_bd_intf_net [get_bd_intf_pins ChannelwiseOp_hls_0/out_V] [get_bd_intf_pins StreamingFIFO_rtl_65/in0_V]
connect_bd_intf_net [get_bd_intf_pins ConvolutionInputGenerator_rtl_0/out_V] [get_bd_intf_pins StreamingFIFO_rtl_3_0/in0_V]
connect_bd_intf_net [get_bd_intf_pins ConvolutionInputGenerator_rtl_1/out_V] [get_bd_intf_pins StreamingFIFO_rtl_11/in0_V]
connect_bd_intf_net [get_bd_intf_pins ConvolutionInputGenerator_rtl_2/out_V] [get_bd_intf_pins StreamingFIFO_rtl_20/in0_V]
connect_bd_intf_net [get_bd_intf_pins ConvolutionInputGenerator_rtl_3/out_V] [get_bd_intf_pins StreamingFIFO_rtl_29/in0_V]
connect_bd_intf_net [get_bd_intf_pins ConvolutionInputGenerator_rtl_4/out_V] [get_bd_intf_pins StreamingFIFO_rtl_38/in0_V]
connect_bd_intf_net [get_bd_intf_pins ConvolutionInputGenerator_rtl_5/out_V] [get_bd_intf_pins StreamingFIFO_rtl_47/in0_V]
connect_bd_intf_net [get_bd_intf_pins ConvolutionInputGenerator_rtl_6/out_V] [get_bd_intf_pins StreamingFIFO_rtl_55/in0_V]
connect_bd_intf_net [get_bd_intf_pins FMPadding_rtl_0/out_V] [get_bd_intf_pins StreamingFIFO_rtl_1_0/in0_V]
connect_bd_intf_net [get_bd_intf_pins FMPadding_rtl_1/out_V] [get_bd_intf_pins StreamingFIFO_rtl_9/in0_V]
connect_bd_intf_net [get_bd_intf_pins FMPadding_rtl_2/out_V] [get_bd_intf_pins StreamingFIFO_rtl_18/in0_V]
connect_bd_intf_net [get_bd_intf_pins FMPadding_rtl_3/out_V] [get_bd_intf_pins StreamingFIFO_rtl_27/in0_V]
connect_bd_intf_net [get_bd_intf_pins FMPadding_rtl_4/out_V] [get_bd_intf_pins StreamingFIFO_rtl_36/in0_V]
connect_bd_intf_net [get_bd_intf_pins FMPadding_rtl_5/out_V] [get_bd_intf_pins StreamingFIFO_rtl_45/in0_V]
connect_bd_intf_net [get_bd_intf_pins FMPadding_rtl_6/out_V] [get_bd_intf_pins StreamingFIFO_rtl_53/in0_V]
connect_bd_intf_net [get_bd_intf_pins LabelSelect_hls_0/out_V] [get_bd_intf_pins StreamingFIFO_rtl_66/in0_V]
connect_bd_intf_net [get_bd_intf_pins MVAU_rtl_0/out_V] [get_bd_intf_pins StreamingFIFO_rtl_5/in0_V]
connect_bd_intf_net [get_bd_intf_pins MVAU_rtl_1/out_V] [get_bd_intf_pins StreamingFIFO_rtl_13/in0_V]
connect_bd_intf_net [get_bd_intf_pins MVAU_rtl_2/out_V] [get_bd_intf_pins StreamingFIFO_rtl_22/in0_V]
connect_bd_intf_net [get_bd_intf_pins MVAU_rtl_3/out_V] [get_bd_intf_pins StreamingFIFO_rtl_31/in0_V]
connect_bd_intf_net [get_bd_intf_pins MVAU_rtl_4/out_V] [get_bd_intf_pins StreamingFIFO_rtl_40/in0_V]
connect_bd_intf_net [get_bd_intf_pins MVAU_rtl_5/out_V] [get_bd_intf_pins StreamingFIFO_rtl_49/in0_V]
connect_bd_intf_net [get_bd_intf_pins MVAU_rtl_6/out_V] [get_bd_intf_pins StreamingFIFO_rtl_57/in0_V]
connect_bd_intf_net [get_bd_intf_pins MVAU_rtl_7/out_V] [get_bd_intf_pins StreamingFIFO_rtl_60/in0_V]
connect_bd_intf_net [get_bd_intf_pins MVAU_rtl_8/out_V] [get_bd_intf_pins StreamingFIFO_rtl_62/in0_V]
connect_bd_intf_net [get_bd_intf_pins MVAU_rtl_9/out_V] [get_bd_intf_pins StreamingFIFO_rtl_64/in0_V]
connect_bd_intf_net [get_bd_intf_pins StreamingDataWidthConverter_rtl_0/out_V] [get_bd_intf_pins StreamingFIFO_rtl_2_0/in0_V]
connect_bd_intf_net [get_bd_intf_pins StreamingDataWidthConverter_rtl_10/out_V] [get_bd_intf_pins StreamingFIFO_rtl_26/in0_V]
connect_bd_intf_net [get_bd_intf_pins StreamingDataWidthConverter_rtl_11/out_V] [get_bd_intf_pins StreamingFIFO_rtl_28/in0_V]
connect_bd_intf_net [get_bd_intf_pins StreamingDataWidthConverter_rtl_12/out_V] [get_bd_intf_pins StreamingFIFO_rtl_30/in0_V]
connect_bd_intf_net [get_bd_intf_pins StreamingDataWidthConverter_rtl_13/out_V] [get_bd_intf_pins StreamingFIFO_rtl_32/in0_V]
connect_bd_intf_net [get_bd_intf_pins StreamingDataWidthConverter_rtl_14/out_V] [get_bd_intf_pins StreamingFIFO_rtl_35/in0_V]
connect_bd_intf_net [get_bd_intf_pins StreamingDataWidthConverter_rtl_15/out_V] [get_bd_intf_pins StreamingFIFO_rtl_37/in0_V]
connect_bd_intf_net [get_bd_intf_pins StreamingDataWidthConverter_rtl_16/out_V] [get_bd_intf_pins StreamingFIFO_rtl_39/in0_V]
connect_bd_intf_net [get_bd_intf_pins StreamingDataWidthConverter_rtl_17/out_V] [get_bd_intf_pins StreamingFIFO_rtl_41/in0_V]
connect_bd_intf_net [get_bd_intf_pins StreamingDataWidthConverter_rtl_18/out_V] [get_bd_intf_pins StreamingFIFO_rtl_44/in0_V]
connect_bd_intf_net [get_bd_intf_pins StreamingDataWidthConverter_rtl_19/out_V] [get_bd_intf_pins StreamingFIFO_rtl_46/in0_V]
connect_bd_intf_net [get_bd_intf_pins StreamingDataWidthConverter_rtl_1/out_V] [get_bd_intf_pins StreamingFIFO_rtl_4/in0_V]
connect_bd_intf_net [get_bd_intf_pins StreamingDataWidthConverter_rtl_20/out_V] [get_bd_intf_pins StreamingFIFO_rtl_48/in0_V]
connect_bd_intf_net [get_bd_intf_pins StreamingDataWidthConverter_rtl_21/out_V] [get_bd_intf_pins StreamingFIFO_rtl_52/in0_V]
connect_bd_intf_net [get_bd_intf_pins StreamingDataWidthConverter_rtl_22/out_V] [get_bd_intf_pins StreamingFIFO_rtl_54/in0_V]
connect_bd_intf_net [get_bd_intf_pins StreamingDataWidthConverter_rtl_23/out_V] [get_bd_intf_pins StreamingFIFO_rtl_56/in0_V]
connect_bd_intf_net [get_bd_intf_pins StreamingDataWidthConverter_rtl_2/out_V] [get_bd_intf_pins StreamingFIFO_rtl_8/in0_V]
connect_bd_intf_net [get_bd_intf_pins StreamingDataWidthConverter_rtl_3/out_V] [get_bd_intf_pins StreamingFIFO_rtl_10/in0_V]
connect_bd_intf_net [get_bd_intf_pins StreamingDataWidthConverter_rtl_4/out_V] [get_bd_intf_pins StreamingFIFO_rtl_12/in0_V]
connect_bd_intf_net [get_bd_intf_pins StreamingDataWidthConverter_rtl_5/out_V] [get_bd_intf_pins StreamingFIFO_rtl_14/in0_V]
connect_bd_intf_net [get_bd_intf_pins StreamingDataWidthConverter_rtl_6/out_V] [get_bd_intf_pins StreamingFIFO_rtl_17/in0_V]
connect_bd_intf_net [get_bd_intf_pins StreamingDataWidthConverter_rtl_7/out_V] [get_bd_intf_pins StreamingFIFO_rtl_19/in0_V]
connect_bd_intf_net [get_bd_intf_pins StreamingDataWidthConverter_rtl_8/out_V] [get_bd_intf_pins StreamingFIFO_rtl_21/in0_V]
connect_bd_intf_net [get_bd_intf_pins StreamingDataWidthConverter_rtl_9/out_V] [get_bd_intf_pins StreamingFIFO_rtl_23/in0_V]
connect_bd_intf_net [get_bd_intf_pins StreamingFIFO_rtl_0/out_V] [get_bd_intf_pins FMPadding_rtl_0/in0_V]
connect_bd_intf_net [get_bd_intf_pins StreamingFIFO_rtl_10/out_V] [get_bd_intf_pins ConvolutionInputGenerator_rtl_1/in0_V]
connect_bd_intf_net [get_bd_intf_pins StreamingFIFO_rtl_11/out_V] [get_bd_intf_pins StreamingDataWidthConverter_rtl_4/in0_V]
connect_bd_intf_net [get_bd_intf_pins StreamingFIFO_rtl_12/out_V] [get_bd_intf_pins MVAU_rtl_1/in0_V]
connect_bd_intf_net [get_bd_intf_pins StreamingFIFO_rtl_13/out_V] [get_bd_intf_pins StreamingDataWidthConverter_rtl_5/in0_V]
connect_bd_intf_net [get_bd_intf_pins StreamingFIFO_rtl_14/out_V] [get_bd_intf_pins Thresholding_rtl_1/in0_V]
connect_bd_intf_net [get_bd_intf_pins StreamingFIFO_rtl_15/out_V] [get_bd_intf_pins StreamingMaxPool_hls_1/in0_V]
connect_bd_intf_net [get_bd_intf_pins StreamingFIFO_rtl_16/out_V] [get_bd_intf_pins StreamingDataWidthConverter_rtl_6/in0_V]
connect_bd_intf_net [get_bd_intf_pins StreamingFIFO_rtl_17/out_V] [get_bd_intf_pins FMPadding_rtl_2/in0_V]
connect_bd_intf_net [get_bd_intf_pins StreamingFIFO_rtl_18/out_V] [get_bd_intf_pins StreamingDataWidthConverter_rtl_7/in0_V]
connect_bd_intf_net [get_bd_intf_pins StreamingFIFO_rtl_19/out_V] [get_bd_intf_pins ConvolutionInputGenerator_rtl_2/in0_V]
connect_bd_intf_net [get_bd_intf_pins StreamingFIFO_rtl_1_0/out_V] [get_bd_intf_pins StreamingFIFO_rtl_1_1/in0_V]
connect_bd_intf_net [get_bd_intf_pins StreamingFIFO_rtl_1_1/out_V] [get_bd_intf_pins StreamingDataWidthConverter_rtl_0/in0_V]
connect_bd_intf_net [get_bd_intf_pins StreamingFIFO_rtl_20/out_V] [get_bd_intf_pins StreamingDataWidthConverter_rtl_8/in0_V]
connect_bd_intf_net [get_bd_intf_pins StreamingFIFO_rtl_21/out_V] [get_bd_intf_pins MVAU_rtl_2/in0_V]
connect_bd_intf_net [get_bd_intf_pins StreamingFIFO_rtl_22/out_V] [get_bd_intf_pins StreamingDataWidthConverter_rtl_9/in0_V]
connect_bd_intf_net [get_bd_intf_pins StreamingFIFO_rtl_23/out_V] [get_bd_intf_pins Thresholding_rtl_2/in0_V]
connect_bd_intf_net [get_bd_intf_pins StreamingFIFO_rtl_24/out_V] [get_bd_intf_pins StreamingMaxPool_hls_2/in0_V]
connect_bd_intf_net [get_bd_intf_pins StreamingFIFO_rtl_25/out_V] [get_bd_intf_pins StreamingDataWidthConverter_rtl_10/in0_V]
connect_bd_intf_net [get_bd_intf_pins StreamingFIFO_rtl_26/out_V] [get_bd_intf_pins FMPadding_rtl_3/in0_V]
connect_bd_intf_net [get_bd_intf_pins StreamingFIFO_rtl_27/out_V] [get_bd_intf_pins StreamingDataWidthConverter_rtl_11/in0_V]
connect_bd_intf_net [get_bd_intf_pins StreamingFIFO_rtl_28/out_V] [get_bd_intf_pins ConvolutionInputGenerator_rtl_3/in0_V]
connect_bd_intf_net [get_bd_intf_pins StreamingFIFO_rtl_29/out_V] [get_bd_intf_pins StreamingDataWidthConverter_rtl_12/in0_V]
connect_bd_intf_net [get_bd_intf_pins StreamingFIFO_rtl_2_0/out_V] [get_bd_intf_pins StreamingFIFO_rtl_2_1/in0_V]
connect_bd_intf_net [get_bd_intf_pins StreamingFIFO_rtl_2_1/out_V] [get_bd_intf_pins ConvolutionInputGenerator_rtl_0/in0_V]
connect_bd_intf_net [get_bd_intf_pins StreamingFIFO_rtl_30/out_V] [get_bd_intf_pins MVAU_rtl_3/in0_V]
connect_bd_intf_net [get_bd_intf_pins StreamingFIFO_rtl_31/out_V] [get_bd_intf_pins StreamingDataWidthConverter_rtl_13/in0_V]
connect_bd_intf_net [get_bd_intf_pins StreamingFIFO_rtl_32/out_V] [get_bd_intf_pins Thresholding_rtl_3/in0_V]
connect_bd_intf_net [get_bd_intf_pins StreamingFIFO_rtl_33/out_V] [get_bd_intf_pins StreamingMaxPool_hls_3/in0_V]
connect_bd_intf_net [get_bd_intf_pins StreamingFIFO_rtl_34/out_V] [get_bd_intf_pins StreamingDataWidthConverter_rtl_14/in0_V]
connect_bd_intf_net [get_bd_intf_pins StreamingFIFO_rtl_35/out_V] [get_bd_intf_pins FMPadding_rtl_4/in0_V]
connect_bd_intf_net [get_bd_intf_pins StreamingFIFO_rtl_36/out_V] [get_bd_intf_pins StreamingDataWidthConverter_rtl_15/in0_V]
connect_bd_intf_net [get_bd_intf_pins StreamingFIFO_rtl_37/out_V] [get_bd_intf_pins ConvolutionInputGenerator_rtl_4/in0_V]
connect_bd_intf_net [get_bd_intf_pins StreamingFIFO_rtl_38/out_V] [get_bd_intf_pins StreamingDataWidthConverter_rtl_16/in0_V]
connect_bd_intf_net [get_bd_intf_pins StreamingFIFO_rtl_39/out_V] [get_bd_intf_pins MVAU_rtl_4/in0_V]
connect_bd_intf_net [get_bd_intf_pins StreamingFIFO_rtl_3_0/out_V] [get_bd_intf_pins StreamingFIFO_rtl_3_1/in0_V]
connect_bd_intf_net [get_bd_intf_pins StreamingFIFO_rtl_3_1/out_V] [get_bd_intf_pins StreamingFIFO_rtl_3_2/in0_V]
connect_bd_intf_net [get_bd_intf_pins StreamingFIFO_rtl_3_2/out_V] [get_bd_intf_pins StreamingFIFO_rtl_3_3/in0_V]
connect_bd_intf_net [get_bd_intf_pins StreamingFIFO_rtl_3_3/out_V] [get_bd_intf_pins StreamingDataWidthConverter_rtl_1/in0_V]
connect_bd_intf_net [get_bd_intf_pins StreamingFIFO_rtl_40/out_V] [get_bd_intf_pins StreamingDataWidthConverter_rtl_17/in0_V]
connect_bd_intf_net [get_bd_intf_pins StreamingFIFO_rtl_41/out_V] [get_bd_intf_pins Thresholding_rtl_4/in0_V]
connect_bd_intf_net [get_bd_intf_pins StreamingFIFO_rtl_42/out_V] [get_bd_intf_pins StreamingMaxPool_hls_4/in0_V]
connect_bd_intf_net [get_bd_intf_pins StreamingFIFO_rtl_43/out_V] [get_bd_intf_pins StreamingDataWidthConverter_rtl_18/in0_V]
connect_bd_intf_net [get_bd_intf_pins StreamingFIFO_rtl_44/out_V] [get_bd_intf_pins FMPadding_rtl_5/in0_V]
connect_bd_intf_net [get_bd_intf_pins StreamingFIFO_rtl_45/out_V] [get_bd_intf_pins StreamingDataWidthConverter_rtl_19/in0_V]
connect_bd_intf_net [get_bd_intf_pins StreamingFIFO_rtl_46/out_V] [get_bd_intf_pins ConvolutionInputGenerator_rtl_5/in0_V]
connect_bd_intf_net [get_bd_intf_pins StreamingFIFO_rtl_47/out_V] [get_bd_intf_pins StreamingDataWidthConverter_rtl_20/in0_V]
connect_bd_intf_net [get_bd_intf_pins StreamingFIFO_rtl_48/out_V] [get_bd_intf_pins MVAU_rtl_5/in0_V]
connect_bd_intf_net [get_bd_intf_pins StreamingFIFO_rtl_49/out_V] [get_bd_intf_pins Thresholding_rtl_5/in0_V]
connect_bd_intf_net [get_bd_intf_pins StreamingFIFO_rtl_4/out_V] [get_bd_intf_pins MVAU_rtl_0/in0_V]
connect_bd_intf_net [get_bd_intf_pins StreamingFIFO_rtl_50/out_V] [get_bd_intf_pins StreamingMaxPool_hls_5/in0_V]
connect_bd_intf_net [get_bd_intf_pins StreamingFIFO_rtl_51/out_V] [get_bd_intf_pins StreamingDataWidthConverter_rtl_21/in0_V]
connect_bd_intf_net [get_bd_intf_pins StreamingFIFO_rtl_52/out_V] [get_bd_intf_pins FMPadding_rtl_6/in0_V]
connect_bd_intf_net [get_bd_intf_pins StreamingFIFO_rtl_53/out_V] [get_bd_intf_pins StreamingDataWidthConverter_rtl_22/in0_V]
connect_bd_intf_net [get_bd_intf_pins StreamingFIFO_rtl_54/out_V] [get_bd_intf_pins ConvolutionInputGenerator_rtl_6/in0_V]
connect_bd_intf_net [get_bd_intf_pins StreamingFIFO_rtl_55/out_V] [get_bd_intf_pins StreamingDataWidthConverter_rtl_23/in0_V]
connect_bd_intf_net [get_bd_intf_pins StreamingFIFO_rtl_56/out_V] [get_bd_intf_pins MVAU_rtl_6/in0_V]
connect_bd_intf_net [get_bd_intf_pins StreamingFIFO_rtl_57/out_V] [get_bd_intf_pins Thresholding_rtl_6/in0_V]
connect_bd_intf_net [get_bd_intf_pins StreamingFIFO_rtl_58/out_V] [get_bd_intf_pins StreamingMaxPool_hls_6/in0_V]
connect_bd_intf_net [get_bd_intf_pins StreamingFIFO_rtl_59/out_V] [get_bd_intf_pins MVAU_rtl_7/in0_V]
connect_bd_intf_net [get_bd_intf_pins StreamingFIFO_rtl_5/out_V] [get_bd_intf_pins Thresholding_rtl_0/in0_V]
connect_bd_intf_net [get_bd_intf_pins StreamingFIFO_rtl_60/out_V] [get_bd_intf_pins Thresholding_rtl_7/in0_V]
connect_bd_intf_net [get_bd_intf_pins StreamingFIFO_rtl_61/out_V] [get_bd_intf_pins MVAU_rtl_8/in0_V]
connect_bd_intf_net [get_bd_intf_pins StreamingFIFO_rtl_62/out_V] [get_bd_intf_pins Thresholding_rtl_8/in0_V]
connect_bd_intf_net [get_bd_intf_pins StreamingFIFO_rtl_63/out_V] [get_bd_intf_pins MVAU_rtl_9/in0_V]
connect_bd_intf_net [get_bd_intf_pins StreamingFIFO_rtl_64/out_V] [get_bd_intf_pins ChannelwiseOp_hls_0/in0_V]
connect_bd_intf_net [get_bd_intf_pins StreamingFIFO_rtl_65/out_V] [get_bd_intf_pins LabelSelect_hls_0/in0_V]
connect_bd_intf_net [get_bd_intf_ports m_axis_0] [get_bd_intf_pins StreamingFIFO_rtl_66/out_V]
connect_bd_intf_net [get_bd_intf_pins StreamingFIFO_rtl_6_0/out_V] [get_bd_intf_pins StreamingFIFO_rtl_6_1/in0_V]
connect_bd_intf_net [get_bd_intf_pins StreamingFIFO_rtl_6_1/out_V] [get_bd_intf_pins StreamingFIFO_rtl_6_2/in0_V]
connect_bd_intf_net [get_bd_intf_pins StreamingFIFO_rtl_6_2/out_V] [get_bd_intf_pins StreamingFIFO_rtl_6_3/in0_V]
connect_bd_intf_net [get_bd_intf_pins StreamingFIFO_rtl_6_3/out_V] [get_bd_intf_pins StreamingFIFO_rtl_6_4/in0_V]
connect_bd_intf_net [get_bd_intf_pins StreamingFIFO_rtl_6_4/out_V] [get_bd_intf_pins StreamingMaxPool_hls_0/in0_V]
connect_bd_intf_net [get_bd_intf_pins StreamingFIFO_rtl_7/out_V] [get_bd_intf_pins StreamingDataWidthConverter_rtl_2/in0_V]
connect_bd_intf_net [get_bd_intf_pins StreamingFIFO_rtl_8/out_V] [get_bd_intf_pins FMPadding_rtl_1/in0_V]
connect_bd_intf_net [get_bd_intf_pins StreamingFIFO_rtl_9/out_V] [get_bd_intf_pins StreamingDataWidthConverter_rtl_3/in0_V]
connect_bd_intf_net [get_bd_intf_pins StreamingMaxPool_hls_0/out_V] [get_bd_intf_pins StreamingFIFO_rtl_7/in0_V]
connect_bd_intf_net [get_bd_intf_pins StreamingMaxPool_hls_1/out_V] [get_bd_intf_pins StreamingFIFO_rtl_16/in0_V]
connect_bd_intf_net [get_bd_intf_pins StreamingMaxPool_hls_2/out_V] [get_bd_intf_pins StreamingFIFO_rtl_25/in0_V]
connect_bd_intf_net [get_bd_intf_pins StreamingMaxPool_hls_3/out_V] [get_bd_intf_pins StreamingFIFO_rtl_34/in0_V]
connect_bd_intf_net [get_bd_intf_pins StreamingMaxPool_hls_4/out_V] [get_bd_intf_pins StreamingFIFO_rtl_43/in0_V]
connect_bd_intf_net [get_bd_intf_pins StreamingMaxPool_hls_5/out_V] [get_bd_intf_pins StreamingFIFO_rtl_51/in0_V]
connect_bd_intf_net [get_bd_intf_pins StreamingMaxPool_hls_6/out_V] [get_bd_intf_pins StreamingFIFO_rtl_59/in0_V]
connect_bd_intf_net [get_bd_intf_pins Thresholding_rtl_0/out_V] [get_bd_intf_pins StreamingFIFO_rtl_6_0/in0_V]
connect_bd_intf_net [get_bd_intf_pins Thresholding_rtl_1/out_V] [get_bd_intf_pins StreamingFIFO_rtl_15/in0_V]
connect_bd_intf_net [get_bd_intf_pins Thresholding_rtl_2/out_V] [get_bd_intf_pins StreamingFIFO_rtl_24/in0_V]
connect_bd_intf_net [get_bd_intf_pins Thresholding_rtl_3/out_V] [get_bd_intf_pins StreamingFIFO_rtl_33/in0_V]
connect_bd_intf_net [get_bd_intf_pins Thresholding_rtl_4/out_V] [get_bd_intf_pins StreamingFIFO_rtl_42/in0_V]
connect_bd_intf_net [get_bd_intf_pins Thresholding_rtl_5/out_V] [get_bd_intf_pins StreamingFIFO_rtl_50/in0_V]
connect_bd_intf_net [get_bd_intf_pins Thresholding_rtl_6/out_V] [get_bd_intf_pins StreamingFIFO_rtl_58/in0_V]
connect_bd_intf_net [get_bd_intf_pins Thresholding_rtl_7/out_V] [get_bd_intf_pins StreamingFIFO_rtl_61/in0_V]
connect_bd_intf_net [get_bd_intf_pins Thresholding_rtl_8/out_V] [get_bd_intf_pins StreamingFIFO_rtl_63/in0_V]
connect_bd_intf_net -intf_net in0_V_0_1 [get_bd_intf_ports s_axis_0] [get_bd_intf_pins StreamingFIFO_rtl_0/in0_V]
